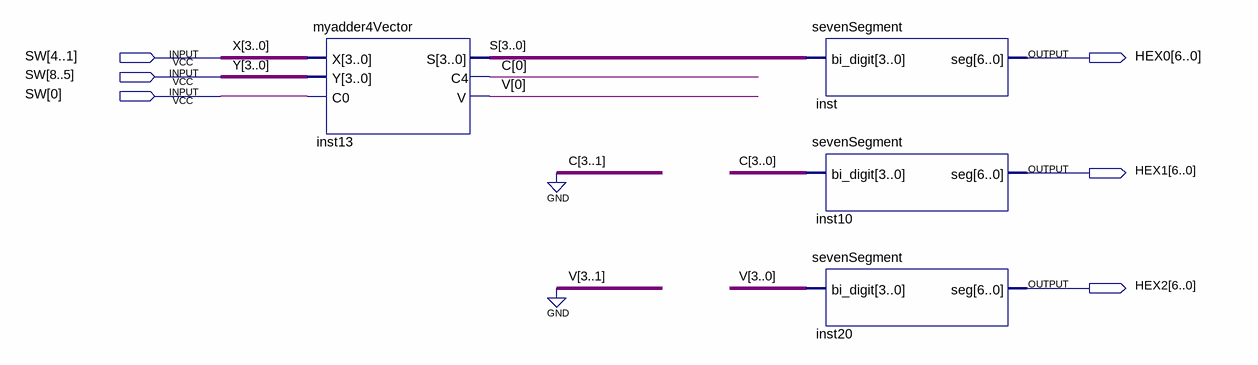
[diagram p0: schematic sheet]
// Quartus schematic Lab5.bdf as structural Verilog: 4 symbols, 6 pins
module Lab5 (
  input  [8:0] SW,
  output [6:0] HEX0,
  output [6:0] HEX1,
  output [6:0] HEX2
);

  wire [0:0] C, V;
  wire [3:0] S;

  myadder4Vector inst13 (.X(SW[4:1]), .Y(SW[8:5]), .C0(SW[0]), .S(S), .C4(C[0]), .V(V[0]));
  sevenSegment inst (.bi_digit(S), .seg(HEX0));
  sevenSegment inst10 (.bi_digit({3'b000, C[0]}), .seg(HEX1));
  sevenSegment inst20 (.bi_digit({3'b000, V[0]}), .seg(HEX2));

  // Other names for the same wires on the sheet: X[3:0] = SW[4:1]; Y[3:0] = SW[8:5]
endmodule
